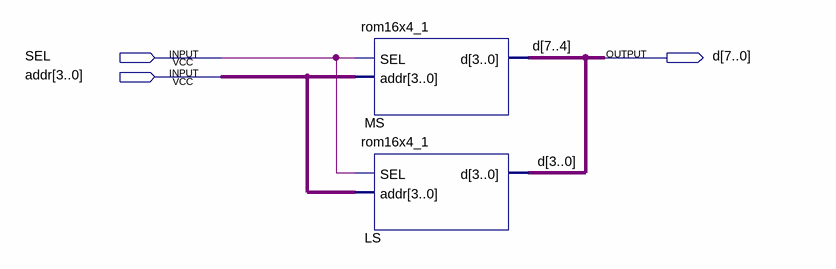
[diagram p0: schematic sheet]
// Quartus schematic rom16x8_1.bdf as structural Verilog: 2 symbols, 3 pins
module rom16x8_1 (
  input  SEL,
  input  [3:0] addr,
  output [7:0] d
);

  rom16x4_1 MS (.SEL(SEL), .addr(addr), .d(d[7:4]));
  rom16x4_1 LS (.SEL(SEL), .addr(addr), .d(d[3:0]));
endmodule
